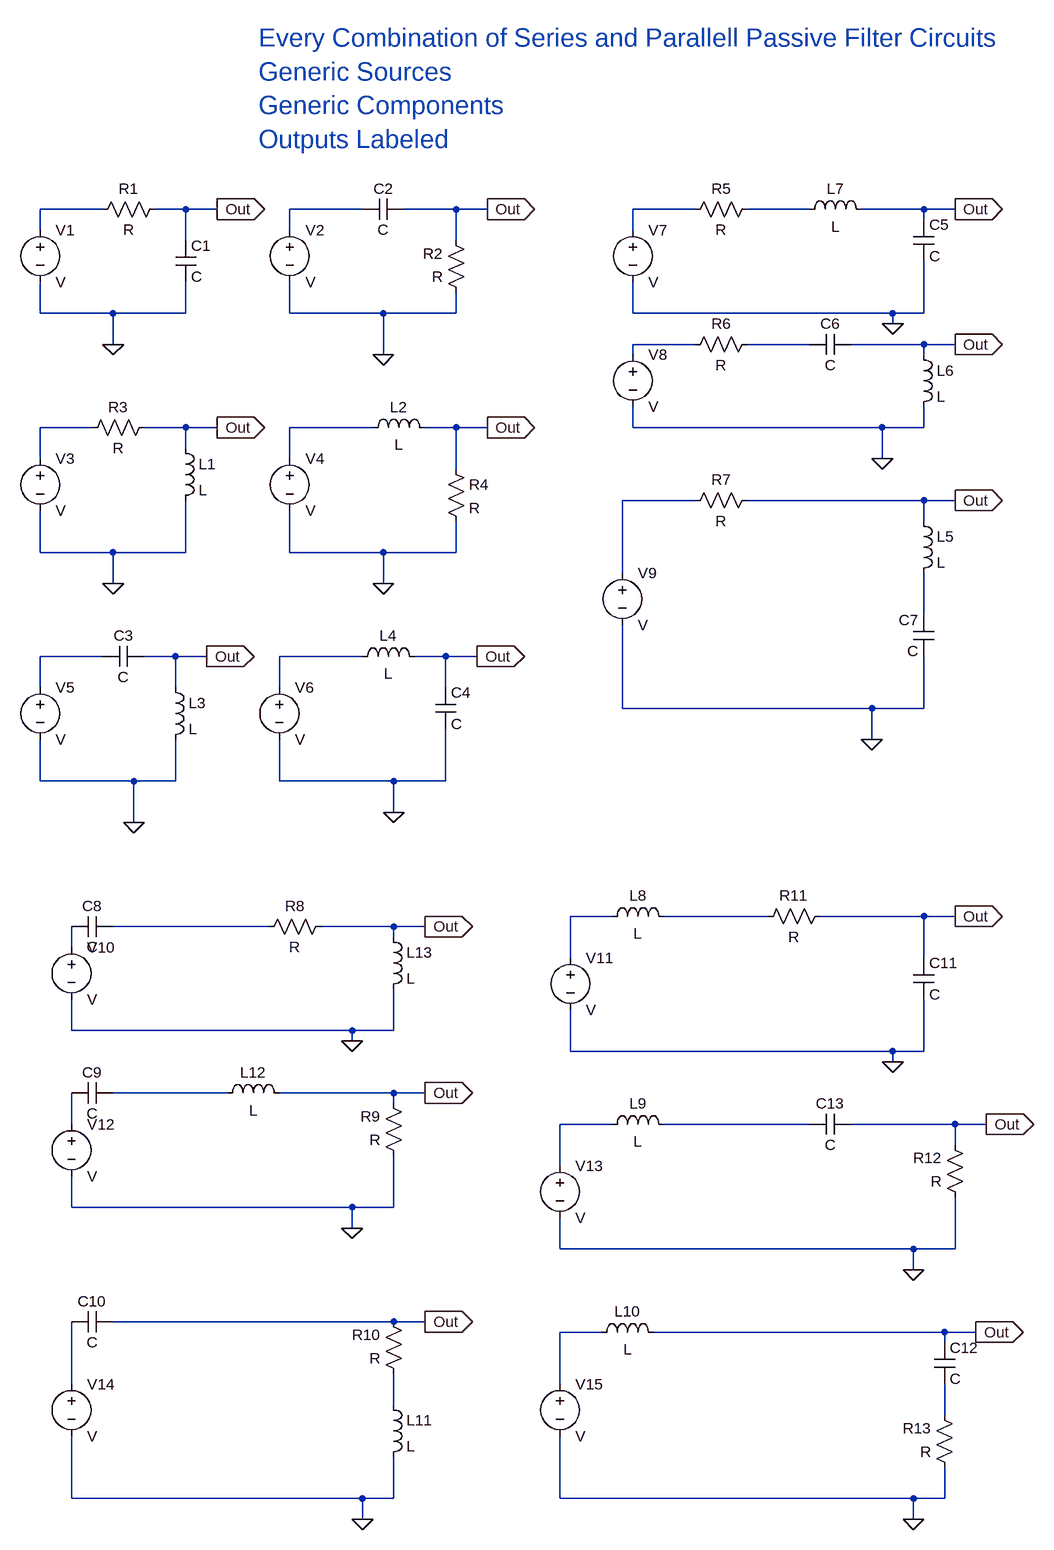
[diagram p0: schematic 1_everyPassiveSeriesCircuit_VoltageSource_Generic.asc]
1_everyPassiveSeriesCircuit_VoltageSource_Generic.asc, the LTspice schematic file:
Version 4
SHEET 1 1920 2148
WIRE -896 64 -992 64
WIRE -768 64 -816 64
WIRE -720 64 -768 64
WIRE -496 64 -608 64
WIRE -352 64 -432 64
WIRE -304 64 -352 64
WIRE 16 64 -80 64
WIRE 192 64 96 64
WIRE 368 64 272 64
WIRE 416 64 368 64
WIRE 368 80 368 64
WIRE -992 96 -992 64
WIRE -608 96 -608 64
WIRE -80 96 -80 64
WIRE -768 112 -768 64
WIRE -352 112 -352 64
WIRE -992 224 -992 176
WIRE -880 224 -992 224
WIRE -768 224 -768 176
WIRE -768 224 -880 224
WIRE -608 224 -608 176
WIRE -464 224 -608 224
WIRE -352 224 -352 192
WIRE -352 224 -464 224
WIRE -80 224 -80 176
WIRE 320 224 -80 224
WIRE 368 224 368 144
WIRE 368 224 320 224
WIRE 320 240 320 224
WIRE -880 272 -880 224
WIRE 16 272 -80 272
WIRE 192 272 96 272
WIRE 368 272 256 272
WIRE 416 272 368 272
WIRE -464 288 -464 224
WIRE -80 288 -80 272
WIRE 368 288 368 272
WIRE -912 400 -992 400
WIRE -768 400 -832 400
WIRE -720 400 -768 400
WIRE -480 400 -608 400
WIRE -352 400 -400 400
WIRE -304 400 -352 400
WIRE -80 400 -80 368
WIRE 304 400 -80 400
WIRE 368 400 368 368
WIRE 368 400 304 400
WIRE -768 432 -768 400
WIRE -992 448 -992 400
WIRE -608 448 -608 400
WIRE 304 448 304 400
WIRE -352 464 -352 400
WIRE 16 512 -96 512
WIRE 368 512 96 512
WIRE 416 512 368 512
WIRE 368 544 368 512
WIRE -992 592 -992 528
WIRE -880 592 -992 592
WIRE -768 592 -768 512
WIRE -768 592 -880 592
WIRE -608 592 -608 528
WIRE -464 592 -608 592
WIRE -352 592 -352 544
WIRE -352 592 -464 592
WIRE -96 624 -96 512
WIRE -880 640 -880 592
WIRE -464 640 -464 592
WIRE 368 688 368 624
WIRE -896 752 -992 752
WIRE -784 752 -832 752
WIRE -736 752 -784 752
WIRE -496 752 -624 752
WIRE -368 752 -416 752
WIRE -320 752 -368 752
WIRE -992 800 -992 752
WIRE -784 800 -784 752
WIRE -624 800 -624 752
WIRE -368 800 -368 752
WIRE -96 832 -96 704
WIRE 288 832 -96 832
WIRE 368 832 368 752
WIRE 368 832 288 832
WIRE 288 880 288 832
WIRE -992 944 -992 880
WIRE -848 944 -992 944
WIRE -784 944 -784 880
WIRE -784 944 -848 944
WIRE -624 944 -624 880
WIRE -448 944 -624 944
WIRE -368 944 -368 864
WIRE -368 944 -448 944
WIRE -448 992 -448 944
WIRE -848 1008 -848 944
WIRE -112 1152 -176 1152
WIRE 128 1152 -32 1152
WIRE 368 1152 208 1152
WIRE 416 1152 368 1152
WIRE -640 1168 -880 1168
WIRE -448 1168 -560 1168
WIRE -400 1168 -448 1168
WIRE -448 1184 -448 1168
WIRE -944 1200 -944 1168
WIRE -176 1216 -176 1152
WIRE 368 1216 368 1152
WIRE -944 1328 -944 1280
WIRE -512 1328 -944 1328
WIRE -448 1328 -448 1264
WIRE -448 1328 -512 1328
WIRE -512 1344 -512 1328
WIRE -176 1360 -176 1296
WIRE 320 1360 -176 1360
WIRE 368 1360 368 1280
WIRE 368 1360 320 1360
WIRE 320 1376 320 1360
WIRE -704 1424 -880 1424
WIRE -448 1424 -624 1424
WIRE -400 1424 -448 1424
WIRE -448 1440 -448 1424
WIRE -944 1472 -944 1424
WIRE -112 1472 -192 1472
WIRE 192 1472 -32 1472
WIRE 416 1472 256 1472
WIRE 464 1472 416 1472
WIRE 416 1504 416 1472
WIRE -192 1536 -192 1472
WIRE -944 1600 -944 1552
WIRE -512 1600 -944 1600
WIRE -448 1600 -448 1520
WIRE -448 1600 -512 1600
WIRE -512 1632 -512 1600
WIRE -192 1664 -192 1616
WIRE 352 1664 -192 1664
WIRE 416 1664 416 1584
WIRE 416 1664 352 1664
WIRE 352 1696 352 1664
WIRE -448 1776 -880 1776
WIRE -400 1776 -448 1776
WIRE -128 1792 -192 1792
WIRE 400 1792 -48 1792
WIRE 448 1792 400 1792
WIRE 400 1808 400 1792
WIRE -944 1872 -944 1776
WIRE -192 1872 -192 1792
WIRE -448 1904 -448 1856
WIRE 400 1920 400 1872
WIRE -944 2048 -944 1952
WIRE -496 2048 -944 2048
WIRE -448 2048 -448 1984
WIRE -448 2048 -496 2048
WIRE -192 2048 -192 1952
WIRE 352 2048 -192 2048
WIRE 400 2048 400 2000
WIRE 400 2048 352 2048
WIRE -496 2080 -496 2048
WIRE 352 2080 352 2048
FLAG -880 272 0
FLAG -464 288 0
FLAG -880 640 0
FLAG -464 640 0
FLAG -448 992 0
FLAG -848 1008 0
FLAG 288 880 0
FLAG 304 448 0
FLAG 320 240 0
FLAG 320 1376 0
FLAG -512 1344 0
FLAG -512 1632 0
FLAG 352 1696 0
FLAG 352 2080 0
FLAG -496 2080 0
FLAG -720 64 Out
IOPIN -720 64 Out
FLAG -304 64 Out
IOPIN -304 64 Out
FLAG 416 64 Out
IOPIN 416 64 Out
FLAG 416 272 Out
IOPIN 416 272 Out
FLAG 416 512 Out
IOPIN 416 512 Out
FLAG -720 400 Out
IOPIN -720 400 Out
FLAG -304 400 Out
IOPIN -304 400 Out
FLAG -736 752 Out
IOPIN -736 752 Out
FLAG -320 752 Out
IOPIN -320 752 Out
FLAG -400 1168 Out
IOPIN -400 1168 Out
FLAG 416 1152 Out
IOPIN 416 1152 Out
FLAG 464 1472 Out
IOPIN 464 1472 Out
FLAG -400 1424 Out
IOPIN -400 1424 Out
FLAG -400 1776 Out
IOPIN -400 1776 Out
FLAG 448 1792 Out
IOPIN 448 1792 Out
SYMBOL res -800 48 R90
WINDOW 0 0 56 VBottom 2
WINDOW 3 32 56 VTop 2
SYMATTR InstName R1
SYMBOL res -336 208 R180
WINDOW 0 36 76 Left 2
WINDOW 3 36 40 Left 2
SYMATTR InstName R2
SYMBOL res -928 416 R270
WINDOW 0 32 56 VTop 2
WINDOW 3 0 56 VBottom 2
SYMATTR InstName R3
SYMBOL res -368 448 R0
SYMATTR InstName R4
SYMBOL cap -784 112 R0
SYMATTR InstName C1
SYMBOL cap -432 48 R90
WINDOW 0 0 32 VBottom 2
WINDOW 3 32 32 VTop 2
SYMATTR InstName C2
SYMBOL ind -784 416 R0
SYMATTR InstName L1
SYMBOL ind -496 416 R270
WINDOW 0 32 56 VTop 2
WINDOW 3 5 56 VBottom 2
SYMATTR InstName L2
SYMBOL cap -832 736 R90
WINDOW 0 0 32 VBottom 2
WINDOW 3 32 32 VTop 2
SYMATTR InstName C3
SYMBOL ind -800 784 R0
SYMATTR InstName L3
SYMBOL cap -384 800 R0
SYMATTR InstName C4
SYMBOL ind -512 768 R270
WINDOW 0 32 56 VTop 2
WINDOW 3 5 56 VBottom 2
SYMATTR InstName L4
SYMBOL res 112 48 R90
WINDOW 0 0 56 VBottom 2
WINDOW 3 32 56 VTop 2
SYMATTR InstName R5
SYMBOL res 112 256 R90
WINDOW 0 0 56 VBottom 2
WINDOW 3 32 56 VTop 2
SYMATTR InstName R6
SYMBOL res 112 496 R90
WINDOW 0 0 56 VBottom 2
WINDOW 3 32 56 VTop 2
SYMATTR InstName R7
SYMBOL cap 352 80 R0
SYMATTR InstName C5
SYMBOL cap 256 256 R90
WINDOW 0 0 32 VBottom 2
WINDOW 3 32 32 VTop 2
SYMATTR InstName C6
SYMBOL cap 384 752 R180
WINDOW 0 24 56 Left 2
WINDOW 3 24 8 Left 2
SYMATTR InstName C7
SYMBOL ind 352 528 R0
SYMATTR InstName L5
SYMBOL ind 352 272 R0
SYMATTR InstName L6
SYMBOL ind 176 80 R270
WINDOW 0 32 56 VTop 2
WINDOW 3 5 56 VBottom 2
SYMATTR InstName L7
SYMBOL cap -880 1152 R90
WINDOW 0 0 32 VBottom 2
WINDOW 3 32 32 VTop 2
SYMATTR InstName C8
SYMBOL cap -880 1408 R90
WINDOW 0 0 32 VBottom 2
WINDOW 3 32 32 VTop 2
SYMATTR InstName C9
SYMBOL cap -880 1760 R90
WINDOW 0 0 32 VBottom 2
WINDOW 3 32 32 VTop 2
SYMATTR InstName C10
SYMBOL ind -128 1168 R270
WINDOW 0 32 56 VTop 2
WINDOW 3 5 56 VBottom 2
SYMATTR InstName L8
SYMBOL ind -128 1488 R270
WINDOW 0 32 56 VTop 2
WINDOW 3 5 56 VBottom 2
SYMATTR InstName L9
SYMBOL ind -144 1808 R270
WINDOW 0 32 56 VTop 2
WINDOW 3 5 56 VBottom 2
SYMATTR InstName L10
SYMBOL res -544 1152 R90
WINDOW 0 0 56 VBottom 2
WINDOW 3 32 56 VTop 2
SYMATTR InstName R8
SYMBOL res -432 1536 R180
WINDOW 0 36 76 Left 2
WINDOW 3 36 40 Left 2
SYMATTR InstName R9
SYMBOL res -432 1872 R180
WINDOW 0 36 76 Left 2
WINDOW 3 36 40 Left 2
SYMATTR InstName R10
SYMBOL ind -464 1888 R0
SYMATTR InstName L11
SYMBOL ind -720 1440 R270
WINDOW 0 32 56 VTop 2
WINDOW 3 5 56 VBottom 2
SYMATTR InstName L12
SYMBOL ind -464 1168 R0
SYMATTR InstName L13
SYMBOL cap 352 1216 R0
SYMATTR InstName C11
SYMBOL cap 384 1808 R0
SYMATTR InstName C12
SYMBOL cap 256 1456 R90
WINDOW 0 0 32 VBottom 2
WINDOW 3 32 32 VTop 2
SYMATTR InstName C13
SYMBOL res 224 1136 R90
WINDOW 0 0 56 VBottom 2
WINDOW 3 32 56 VTop 2
SYMATTR InstName R11
SYMBOL res 432 1600 R180
WINDOW 0 36 76 Left 2
WINDOW 3 36 40 Left 2
SYMATTR InstName R12
SYMBOL res 416 2016 R180
WINDOW 0 36 76 Left 2
WINDOW 3 36 40 Left 2
SYMATTR InstName R13
SYMBOL voltage -992 80 R0
SYMATTR InstName V1
SYMBOL voltage -608 80 R0
SYMATTR InstName V2
SYMBOL voltage -992 432 R0
SYMATTR InstName V3
SYMBOL voltage -608 432 R0
SYMATTR InstName V4
SYMBOL voltage -992 784 R0
SYMATTR InstName V5
SYMBOL voltage -624 784 R0
SYMATTR InstName V6
SYMBOL voltage -80 80 R0
SYMATTR InstName V7
SYMBOL voltage -80 272 R0
SYMATTR InstName V8
SYMBOL voltage -96 608 R0
SYMATTR InstName V9
SYMBOL voltage -944 1184 R0
SYMATTR InstName V10
SYMBOL voltage -176 1200 R0
SYMATTR InstName V11
SYMBOL voltage -944 1456 R0
SYMATTR InstName V12
SYMBOL voltage -192 1520 R0
SYMATTR InstName V13
SYMBOL voltage -944 1856 R0
SYMATTR InstName V14
SYMBOL voltage -192 1856 R0
SYMATTR InstName V15
TEXT -656 -200 Left 4 ;Every Combination of Series and Parallell Passive Filter Circuits\nGeneric Sources\nGeneric Components\nOutputs Labeled

The netlist it stands for:
* 1_everyPassiveSeriesCircuit_VoltageSource_Generic.asc
R1 Out N001 R
R2 0 Out R
R3 N007 Out R
R4 Out 0 R
C1 Out 0 C
C2 Out N002 C
L1 Out 0 L
L2 N008 Out L
C3 Out N011 C
L3 Out 0 L
C4 Out 0 C
L4 N012 Out L
R5 N004 N003 R
R6 N006 N005 R
R7 Out N009 R
C5 Out 0 C
C6 Out N006 C
C7 0 N010 C
L5 Out N010 L
L6 Out 0 L
L7 N004 Out L
C8 N015 N016 C
C9 N017 N018 C
C10 Out N022 C
L8 N013 N014 L
L9 N019 N020 L
L10 N021 Out L
R8 Out N015 R
R9 0 Out R
R10 N023 Out R
L11 N023 0 L
L12 N017 Out L
L13 Out 0 L
C11 Out 0 C
C12 Out N024 C
C13 Out N020 C
R11 Out N014 R
R12 0 Out R
R13 0 N024 R
V1 N001 0 V
V2 N002 0 V
V3 N007 0 V
V4 N008 0 V
V5 N011 0 V
V6 N012 0 V
V7 N003 0 V
V8 N005 0 V
V9 N009 0 V
V10 N016 0 V
V11 N013 0 V
V12 N018 0 V
V13 N019 0 V
V14 N022 0 V
V15 N021 0 V
* Every Combination of Series and Parallell Passive Filter Circuits
* Generic Sources
* Generic Components
* Outputs Labeled
.backanno
.end